# Altium project KISS_Spartan3.PrjPcb
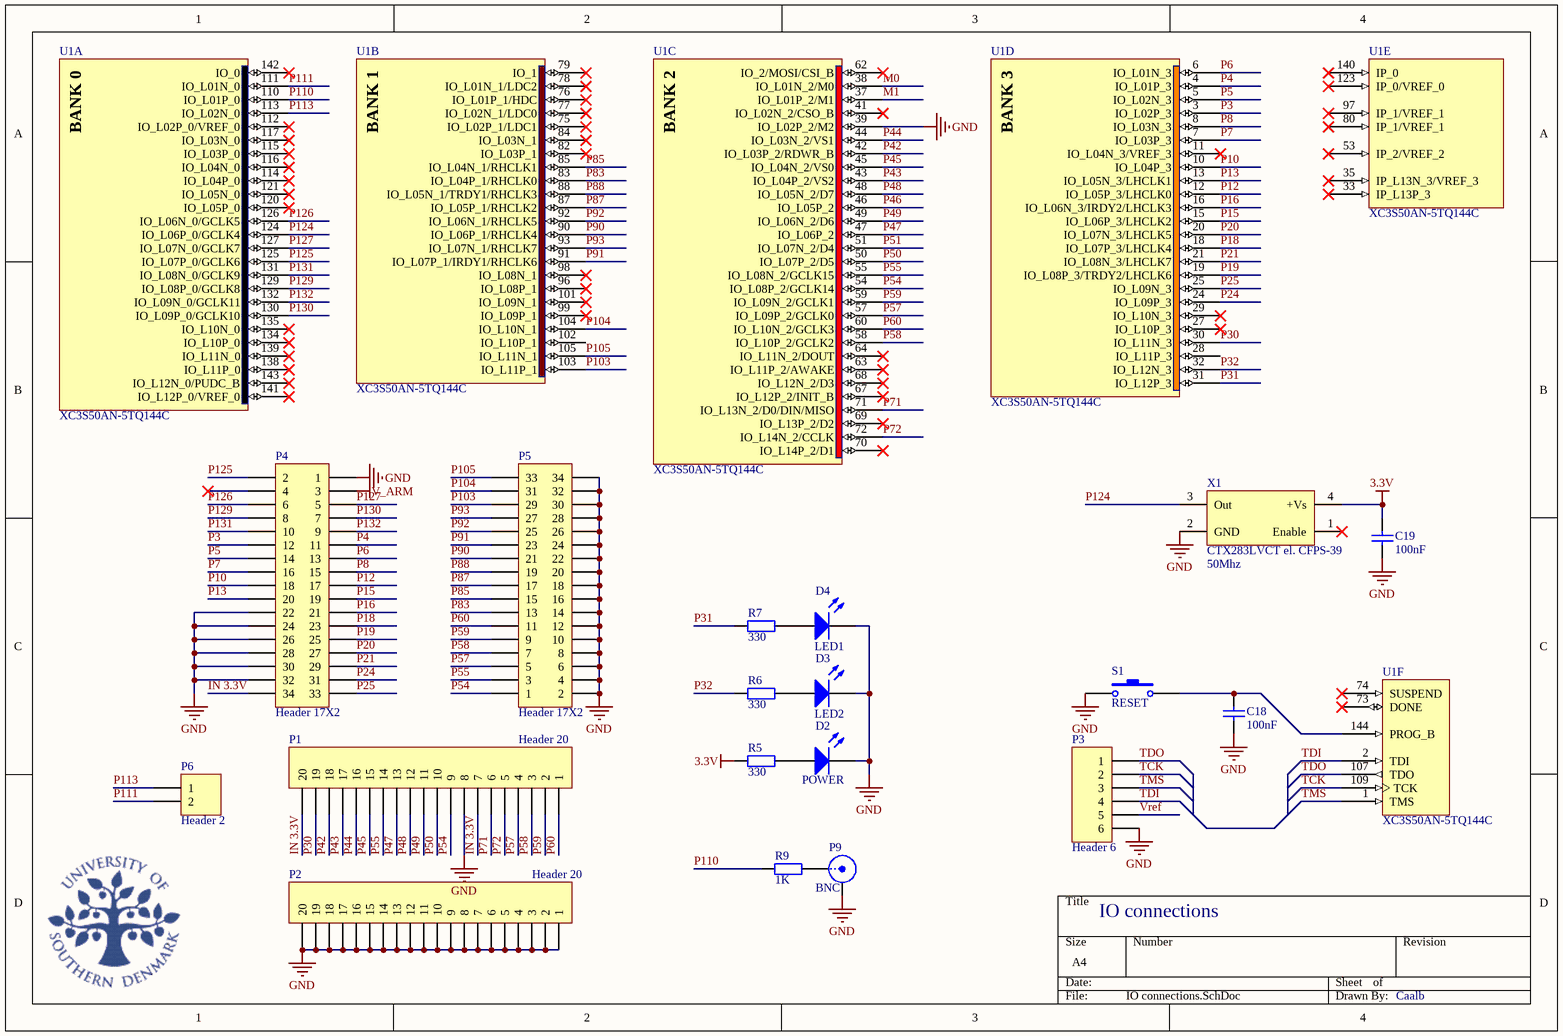
[diagram p0: IO connections.SchDoc]
2 sheets, 67 parts. Net scope: global (net labels, ports and power ports of the same name join across sheets).
Board file: PCB.PcbDoc
Sheets:
  IO connections.SchDoc
  Power.SchDoc

## Sheet IO connections.SchDoc
size A4; PageSetup: Record=PageOptions|CenterHorizontal=True|CenterVertical=True|PrintScale=0.98|XCorrection=1.00|YCorrection=1.00|PrintKind=0|BorderSize=5000000|LeftOffset=0|BottomOffset=0|Orientation=2|PaperLength=1000|PaperWidth=1000|Scale=100|PaperSource=7|PrintQuality=-4|MediaType=1|DitherType=10|PaperKind=A4|PrintScaleMode=1

### Parts
C18  value 100nF  [0805]  (hidden comment: Cap)
C19  value 100nF  [0805]  (hidden comment: Cap)
D2  POWER  [LED1206]
D3  LED2  [LED1206]
D4  LED1  [LED1206]
P1  Header 20  [HDR1X20 Kant Special]
P2  Header 20  [HDR1X20 Kant]
P3  Header 6  [HDR1X6]
P4  Header 17X2  [HDR2X10/17FLAD Combi]
P5  Header 17X2  [HDR2X17FLAD Special]
P6  Header 2  [HDR1X2]
P9  BNC  [Miniature Coaxial Connectors]
R5  value 330  [0805]  (hidden comment: Res2)
R6  value 330  [0805]  (hidden comment: Res2)
R7  value 330  [0805]  (hidden comment: Res2)
R9  value 1K  [0805]  (hidden comment: Res2)
S1  RESET  [B3U-3000P]
U1  XC3S50AN-5TQ144C  [TQ144_L]  (parts A,B,C,D,E,F of 8)
X1  CTX283LVCT el. CFPS-39  value 50Mhz  [CB3LV-3C/CFPS-39]

### Nets
3.3V: C19.2 R5.2 X1.4(+Vs)
GND: C18.1 C19.1 D2.2(K) D3.2(K) D4.2(K) P1.8 P2.1 P2.2 P2.3 P2.4 P2.5 P2.6 P2.7 P2.8 P2.9 P2.10 P2.11 P2.12 P2.13 P2.14 P2.15 P2.16 P2.17 P2.18 P2.19 P2.20 P3.6 P4.1 P4.22 P4.24 P4.26 P4.28 P4.30 P4.32 P5.2 P5.4 P5.6 P5.8 P5.10 P5.12 P5.14 P5.16 P5.18 P5.20 P5.22 P5.24 P5.26 P5.28 P5.30 P5.32 P5.34 P9.2(Y) S1.1 U1.39(IO_L02P_2/M2) X1.2(GND)
V_ARM: P4.3
IN 3.3V: P1.7 P1.20 P4.34
M0: U1.38(IO_L01N_2/M0)
M1: U1.37(IO_L01P_2/M1)
P3: P4.12 U1.3(IO_L02P_3)
P4: P4.11 U1.4(IO_L01P_3)
P5: P4.14 U1.5(IO_L02N_3)
P6: P4.13 U1.6(IO_L01N_3)
P7: P4.16 U1.7(IO_L03P_3)
P8: P4.15 U1.8(IO_L03N_3)
P10: P4.18 U1.10(IO_L04P_3)
P12: P4.17 U1.12(IO_L05P_3/LHCLK0)
P13: P4.20 U1.13(IO_L05N_3/LHCLK1)
P15: P4.19 U1.15(IO_L06P_3/LHCLK2)
P16: P4.21 U1.16(IO_L06N_3/IRDY2/LHCLK3)
P18: P4.23 U1.18(IO_L07P_3/LHCLK4)
P19: P4.25 U1.19(IO_L08P_3/TRDY2/LHCLK6)
P20: P4.27 U1.20(IO_L07N_3/LHCLK5)
P21: P4.29 U1.21(IO_L08N_3/LHCLK7)
P24: P4.31 U1.24(IO_L09P_3)
P25: P4.33 U1.25(IO_L09N_3)
P30: P1.19 U1.30(IO_L11N_3)
P31: R7.2 U1.31(IO_L12P_3)
P32: R6.2 U1.32(IO_L12N_3)
P42: P1.18 U1.42(IO_L03P_2/RDWR_B)
P43: P1.17 U1.43(IO_L04P_2/VS2)
P44: P1.16 U1.44(IO_L03N_2/VS1)
P45: P1.15 U1.45(IO_L04N_2/VS0)
P46: U1.46(IO_L05P_2)
P47: P1.13 U1.47(IO_L06P_2)
P48: P1.12 U1.48(IO_L05N_2/D7)
P49: P1.11 U1.49(IO_L06N_2/D6)
P50: P1.10 U1.50(IO_L07P_2/D5)
P51: U1.51(IO_L07N_2/D4)
P54: P1.9 P5.1 U1.54(IO_L08P_2/GCLK14)
P55: P1.14 P5.3 U1.55(IO_L08N_2/GCLK15)
P57: P1.4 P5.5 U1.57(IO_L09P_2/GCLK0)
P58: P1.3 P5.7 U1.58(IO_L10P_2/GCLK2)
P59: P1.2 P5.9 U1.59(IO_L09N_2/GCLK1)
P60: P1.1 P5.11 U1.60(IO_L10N_2/GCLK3)
P71: P1.6 U1.71(IO_L13N_2/D0/DIN/MISO)
P72: P1.5 U1.72(IO_L14N_2/CCLK)
P83: P5.13 U1.83(IO_L04P_1/RHCLK0)
P85: P5.15 U1.85(IO_L04N_1/RHCLK1)
P87: P5.17 U1.87(IO_L05P_1/RHCLK2)
P88: P5.19 U1.88(IO_L05N_1/TRDY1/RHCLK3)
P90: P5.21 U1.90(IO_L06P_1/RHCLK4)
P91: P5.23 U1.91(IO_L07P_1/IRDY1/RHCLK6)
P92: P5.25 U1.92(IO_L06N_1/RHCLK5)
P93: P5.27 U1.93(IO_L07N_1/RHCLK7)
P103: P5.29 U1.103(IO_L11P_1)
P104: P5.31 U1.104(IO_L10N_1)
P105: P5.33 U1.105(IO_L11N_1)
P110: R9.1 U1.110(IO_L01P_0)
P111: P6.2 U1.111(IO_L01N_0)
P113: P6.1 U1.113(IO_L02N_0)
P124: U1.124(IO_L06P_0/GCLK4) X1.3(Out)
P125: P4.2 U1.125(IO_L07P_0/GCLK6)
P126: P4.6 U1.126(IO_L06N_0/GCLK5)
P127: P4.5 U1.127(IO_L07N_0/GCLK7)
P129: P4.8 U1.129(IO_L08P_0/GCLK8)
P130: P4.7 U1.130(IO_L09P_0/GCLK10)
P131: P4.10 U1.131(IO_L08N_0/GCLK9)
P132: P4.9 U1.132(IO_L09N_0/GCLK11)
TCK: P3.2 U1.109(TCK)
TDI: P3.4 U1.2(TDI)
TDO: P3.1 U1.107(TDO)
TMS: P3.3 U1.1(TMS)
Vref: P3.5
NetC18_2: C18.2 S1.2 U1.144(PROG_B)
NetD2_1: D2.1(A) R5.1
NetD3_1: D3.1(A) R6.1
NetD4_1: D4.1(A) R7.1
NetP9_1: P9.1(X) R9.2

Not connected (* = marked no-connect by the designer): P4 4*; U1 11(IO_L04N_3/VREF_3)* 27(IO_L10P_3)* 28(IO_L11P_3) 29(IO_L10N_3)* 33(IP_L13P_3)* 35(IP_L13N_3/VREF_3)* 41(IO_L02N_2/CSO_B)* 53(IP_2/VREF_2)* 62(IO_2/MOSI/CSI_B)* 63(IO_L11P_2/AWAKE)* 64(IO_L11N_2/DOUT)* 67(IO_L12P_2/INIT_B)* 68(IO_L12N_2/D3)* 69(IO_L13P_2/D2)* 70(IO_L14P_2/D1)* 73(DONE)* 74(SUSPEND)* 75(IO_L02P_1/LDC1)* 76(IO_L01P_1/HDC)* 77(IO_L02N_1/LDC0)* 78(IO_L01N_1/LDC2)* 79(IO_1)* 80(IP_1/VREF_1)* 82(IO_L03P_1)* 84(IO_L03N_1)* 96(IO_L08P_1)* 97(IP_1/VREF_1)* 98(IO_L08N_1)* 99(IO_L09P_1)* 101(IO_L09N_1)* 102(IO_L10P_1) 112(IO_L02P_0/VREF_0)* 114(IO_L04P_0)* 115(IO_L03P_0)* 116(IO_L04N_0)* 117(IO_L03N_0)* 120(IO_L05P_0)* 121(IO_L05N_0)* 123(IP_0/VREF_0)* 134(IO_L10P_0)* 135(IO_L10N_0)* 138(IO_L11P_0)* 139(IO_L11N_0)* 140(IP_0)* 141(IO_L12P_0/VREF_0)* 142(IO_0)* 143(IO_L12N_0/PUDC_B)*; X1 1(Enable)*

### Notes on the sheet
- IO connections
- Caalb
- (in symbol XC3S50AN-5TQ144C, part A) BANK 0
- (in symbol XC3S50AN-5TQ144C, part B) BANK 1
- (in symbol XC3S50AN-5TQ144C, part C) BANK 2
- (in symbol XC3S50AN-5TQ144C, part D) BANK 3

### Library data of the parts
C18 C19 = Cap: !Capacitor; Published: 8-Jun-2000; LatestRevisionDate: 17-Jul-2002; LatestRevisionNote: Re-released for DXP Platform.; PackageReference: RAD-0.3; Publisher: Altium Limited
D2-D4 = LED0: LED; Published: 8-Jun-2000; LatestRevisionDate: 08-Jul-2005; LatestRevisionNote: Mech Layer 1 removed.; Publisher: Altium Limited
  D2: PackageReference: YE
  D3: PackageReference: GR
  D4: PackageReference: RD
P1 P2 = Header 20: Header, 20-Pin; LatestRevisionDate: 17-Jul-2002; LatestRevisionNote: Re-released for DXP Platform.; Publisher: Altium Limited
P3 = Header 6: Header, 6-Pin; LatestRevisionDate: 17-Jul-2002; LatestRevisionNote: Re-released for DXP Platform.; Publisher: Altium Limited
P4 P5 = Header 17X2: Header, 17-Pin, Dual row; LatestRevisionDate: 17-Jul-2002; LatestRevisionNote: Re-released for DXP Platform.; Publisher: Altium Limited
P6 = Header 2: Header, 2-Pin; LatestRevisionDate: 17-Jul-2002; LatestRevisionNote: Re-released for DXP Platform.; Publisher: Altium Limited
P9 = BNC: Miniature Coaxial Connectors; LatestRevisionDate: 17-Jul-2002; LatestRevisionNote: Re-released for DXP Platform.; Publisher: Altium Limited
R5-R7 R9 = Res2: !Resistor; Published: 8-Jun-2000; Publisher: Altium Limited
  R5-R7: LatestRevisionDate: 17-Jul-2002; LatestRevisionNote: Re-released for DXP Platform.; PackageReference: AXIAL-0.4
  R9: Revision: July-2002: Re-released for DXP Platform.
S1 = SW-PB: Switch; Published: 24-Mar-1999; LatestRevisionDate: 17-Jul-2002; LatestRevisionNote: Re-released for DXP Platform.; PackageReference: SPST-2; Publisher: Altium Limited
U1 = XC3S50AN-5TQ144C: Spartan-3AN Non-Volatile FPGA, 108 User I/Os, 144-Pin TQFP, High Performance, Commercial Grade; Published: 20-Jul-2007; DatasheetVersion: 26-Feb-2007; PackageVersion: ver1.2, Jun-2004; PackageReference: TQ144; Publisher: Altium Limited; PackageDescription: 144-Pin Thin Quad Flat Pack (TQ144); Code_JEDEC: MS-026-BFB; ComponentLink1Description: Manufacturer Link; ComponentLink1URL: http://www.xilinx.com/products/silicon_solutions/fpgas/spartan_series/spartan3an_fpgas/index.htm; ComponentLink2Description: Datasheet; ComponentLink2URL: http://direct.xilinx.com/bvdocs/publications/ds557.pdf
X1 = CFPS-39: 3.3V, ultra minature surface mount oscillator

## Sheet Power.SchDoc
size A4; PageSetup: Record=PageOptions|CenterHorizontal=True|CenterVertical=True|PrintScale=0.98|XCorrection=1.00|YCorrection=1.00|PrintKind=0|BorderSize=5000000|LeftOffset=0|BottomOffset=0|Orientation=2|PaperLength=1000|PaperWidth=1000|Scale=100|PaperSource=7|PrintQuality=-4|MediaType=1|DitherType=10|PaperKind=A4|PrintScaleMode=1
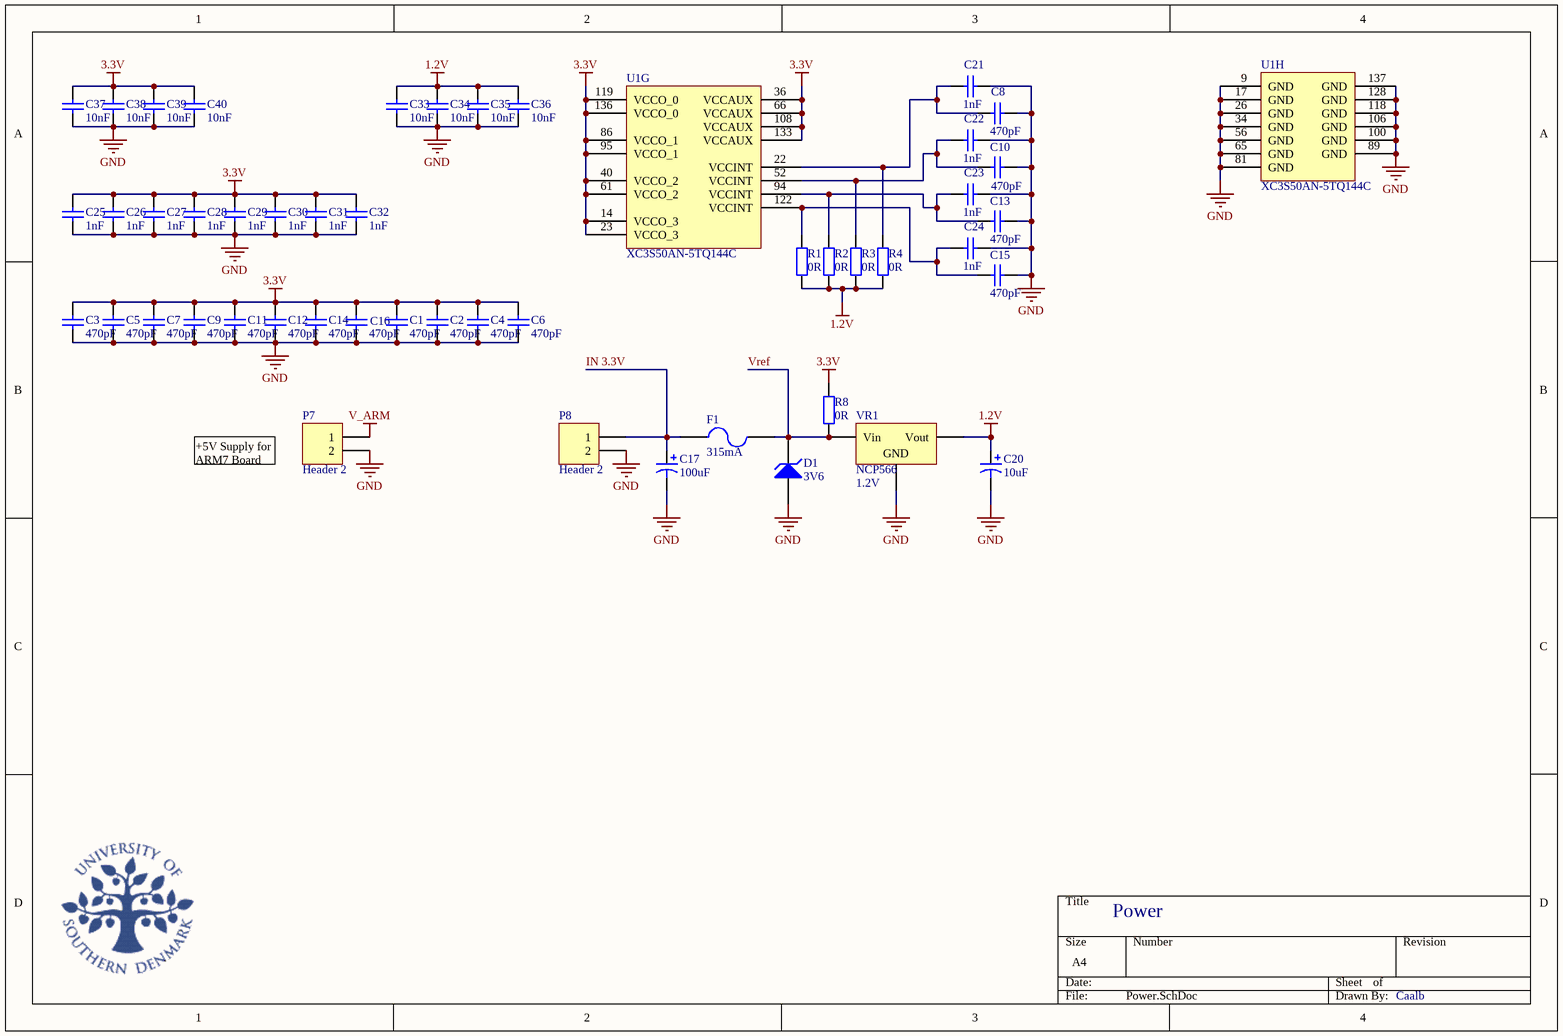
[diagram p1: Power.SchDoc]

### Parts
C1  value 470pF  [0603]  (hidden comment: Cap)
C2  value 470pF  [0603]  (hidden comment: Cap)
C3  value 470pF  [0603]  (hidden comment: Cap)
C4  value 470pF  [0603]  (hidden comment: Cap)
C5  value 470pF  [0603]  (hidden comment: Cap)
C6  value 470pF  [0603]  (hidden comment: Cap)
C7  value 470pF  [0603]  (hidden comment: Cap)
C8  value 470pF  [0603]  (hidden comment: Cap)
C9  value 470pF  [0603]  (hidden comment: Cap)
C10  value 470pF  [0603]  (hidden comment: Cap)
C11  value 470pF  [0603]  (hidden comment: Cap)
C12  value 470pF  [0603]  (hidden comment: Cap)
C13  value 470pF  [0603]  (hidden comment: Cap)
C14  value 470pF  [0603]  (hidden comment: Cap)
C15  value 470pF  [0603]  (hidden comment: Cap)
C16  value 470pF  [0603]  (hidden comment: Cap)
C17  value 100uF  [Tantal 100uF 10V (lager)]  (hidden comment: Cap Pol1)
C20  value 10uF  [1206Pol]  (hidden comment: Cap Pol1)
C21  value 1nF  [0603]  (hidden comment: Cap)
C22  value 1nF  [0603]  (hidden comment: Cap)
C23  value 1nF  [0603]  (hidden comment: Cap)
C24  value 1nF  [0603]  (hidden comment: Cap)
C25  value 1nF  [0603]  (hidden comment: Cap)
C26  value 1nF  [0603]  (hidden comment: Cap)
C27  value 1nF  [0603]  (hidden comment: Cap)
C28  value 1nF  [0603]  (hidden comment: Cap)
C29  value 1nF  [0603]  (hidden comment: Cap)
C30  value 1nF  [0603]  (hidden comment: Cap)
C31  value 1nF  [0603]  (hidden comment: Cap)
C32  value 1nF  [0603]  (hidden comment: Cap)
C33  value 10nF  [0603]  (hidden comment: Cap)
C34  value 10nF  [0603]  (hidden comment: Cap)
C35  value 10nF  [0603]  (hidden comment: Cap)
C36  value 10nF  [0603]  (hidden comment: Cap)
C37  value 10nF  [1206]  (hidden comment: Cap)
C38  value 10nF  [1206]  (hidden comment: Cap)
C39  value 10nF  [1206]  (hidden comment: Cap)
C40  value 10nF  [1206]  (hidden comment: Cap)
D1  3V6  [d1206]
F1  315mA  [1206]
P7  Header 2  [HDR2x1 M LÅS]
P8  Header 2  [HDR2x1 M LÅS]
R1  value 0R  [J0805]  (hidden comment: Res2)
R2  value 0R  [J0805]  (hidden comment: Res2)
R3  value 0R  [J0805]  (hidden comment: Res2)
R4  value 0R  [J0805]  (hidden comment: Res2)
R8  value 0R  [J0805]  (hidden comment: Res2)
U1  XC3S50AN-5TQ144C  [TQ144_L]  (parts G,H of 8)
VR1  NCP566  value 1.2V  [SOT-223]

### Nets
1.2V: C20.1 C33.2 C34.2 C35.2 C36.2 R1.1 R2.1 R3.1 R4.1 VR1.3(Vout)
3.3V: C1.1 C2.1 C3.2 C4.1 C5.2 C6.1 C7.2 C9.2 C11.2 C12.2 C14.2 C16.2 C25.2 C26.2 C27.2 C28.2 C29.2 C30.2 C31.2 C32.2 C37.2 C38.2 C39.2 C40.2 R8.1 U1.14(VCCO_3) U1.23(VCCO_3) U1.36(VCCAUX) U1.40(VCCO_2) U1.61(VCCO_2) U1.66(VCCAUX) U1.86(VCCO_1) U1.95(VCCO_1) U1.108(VCCAUX) U1.119(VCCO_0) U1.133(VCCAUX) U1.136(VCCO_0)
GND: C1.2 C2.2 C3.1 C4.2 C5.1 C6.2 C7.1 C8.2 C9.1 C10.2 C11.1 C12.1 C13.2 C14.1 C15.2 C16.1 C17.2 C20.2 C21.2 C22.2 C23.2 C24.2 C25.1 C26.1 C27.1 C28.1 C29.1 C30.1 C31.1 C32.1 C33.1 C34.1 C35.1 C36.1 C37.1 C38.1 C39.1 C40.1 D1.1(A) P7.2 P8.2 U1.9(GND) U1.17(GND) U1.26(GND) U1.34(GND) U1.56(GND) U1.65(GND) U1.81(GND) U1.89(GND) U1.100(GND) U1.106(GND) U1.118(GND) U1.128(GND) U1.137(GND) VR1.2(GND)
V_ARM: P7.1
IN 3.3V: C17.1 F1.1 P8.1
Vref: D1.2(K) F1.2 R8.2 VR1.1(Vin)
NetC8_1: C8.1 C21.1 R4.2 U1.22(VCCINT)
NetC10_1: C10.1 C22.1 R3.2 U1.52(VCCINT)
NetC13_1: C13.1 C23.1 R2.2 U1.94(VCCINT)
NetC15_1: C15.1 C24.1 R1.2 U1.122(VCCINT)

### Notes on the sheet
- +5V Supply for ARM7 Board
- Power
- Caalb

### Library data of the parts
C1-C16 C21-C40 = Cap: !Capacitor; Published: 8-Jun-2000; LatestRevisionDate: 17-Jul-2002; LatestRevisionNote: Re-released for DXP Platform.; PackageReference: RAD-0.3; Publisher: Altium Limited
C17 C20 = Cap Pol1: !Polarized Capacitor (Radial); Published: 8-Jun-2000; LatestRevisionDate: 17-Jul-2002; LatestRevisionNote: Re-released for DXP Platform.; PackageReference: RB7.6-15; Publisher: Altium Limited
D1 = D Zener: Zener Diode; Value: 3.5V; Published: 8-Jun-2000; LatestRevisionDate: 17-Jul-2002; LatestRevisionNote: Re-released for DXP Platform.; PackageReference: DIODE-0.7; Publisher: Altium Limited
F1 = Fuse 2: Fuse; Published: 8-Jun-2000; LatestRevisionDate: 17-Jul-2002; LatestRevisionNote: Re-released for DXP Platform.; PackageReference: PIN-W2/E2.8; Publisher: Altium Limited
P7 P8 = Header 2: Header, 2-Pin M LÅS; LatestRevisionDate: 17-Jul-2002; LatestRevisionNote: Re-released for DXP Platform.; Publisher: Altium Limited
R1-R4 R8 = Res2: !Resistor; Published: 8-Jun-2000; LatestRevisionDate: 17-Jul-2002; LatestRevisionNote: Re-released for DXP Platform.; PackageReference: AXIAL-0.4; Publisher: Altium Limited
U1 = XC3S50AN-5TQ144C: as U1 on sheet IO connections; Published: 20-Jul-2007; DatasheetVersion: 26-Feb-2007; PackageVersion: ver1.2, Jun-2004; PackageReference: TQ144; Publisher: Altium Limited; PackageDescription: 144-Pin Thin Quad Flat Pack (TQ144); Code_JEDEC: MS-026-BFB; ComponentLink1Description: Manufacturer Link; ComponentLink1URL: http://www.xilinx.com/products/silicon_solutions/fpgas/spartan_series/spartan3an_fpgas/index.htm; ComponentLink2Description: Datasheet; ComponentLink2URL: http://direct.xilinx.com/bvdocs/publications/ds557.pdf
VR1 = Volt Reg: Volt Reg NCP566; Published: 24-Mar-1999; LatestRevisionDate: 17-Jul-2002; LatestRevisionNote: Re-released for DXP Platform.; PackageReference: D2PAK; Publisher: Altium Limited; Code_JEDEC: SMD-220

## Nets that join several sheets
3.3V: IO connections (C19.2 R5.2 X1.4), Power (37 pins)
GND: IO connections (55 pins), Power (55 pins)
V_ARM: IO connections (P4.3), Power (P7.1)
IN 3.3V: IO connections (P1.7 P1.20 P4.34), Power (C17.1 F1.1 P8.1)
Vref: IO connections (P3.5), Power (D1.2 F1.2 R8.2 VR1.1)